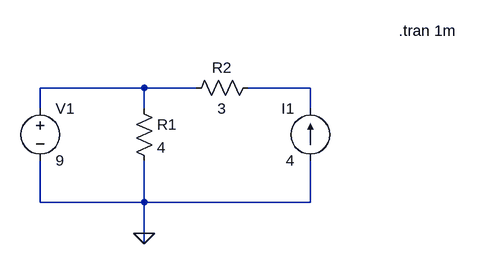
[diagram p0: schematic Q3 att 3.asc]
Q3 att 3.asc, the LTspice schematic file:
Version 4.1
SHEET 1 880 680
WIRE 144 112 -16 112
WIRE 224 112 144 112
WIRE 400 112 304 112
WIRE -16 144 -16 112
WIRE 144 144 144 112
WIRE 400 144 400 112
WIRE -16 288 -16 224
WIRE 144 288 144 224
WIRE 144 288 -16 288
WIRE 400 288 400 224
WIRE 400 288 144 288
WIRE 144 336 144 288
WIRE 144 352 144 336
FLAG 144 336 0
SYMBOL res 128 128 R0
SYMATTR InstName R1
SYMATTR Value 4
SYMBOL res 320 96 R90
WINDOW 0 0 56 VBottom 2
WINDOW 3 32 56 VTop 2
SYMATTR InstName R2
SYMATTR Value 3
SYMBOL voltage -16 128 R0
WINDOW 123 0 0 Left 0
WINDOW 39 0 0 Left 0
SYMATTR InstName V1
SYMATTR Value 9
SYMBOL current 400 224 R180
WINDOW 0 24 80 Left 2
WINDOW 3 24 0 Left 2
WINDOW 123 0 0 Left 0
WINDOW 39 0 0 Left 0
SYMATTR InstName I1
SYMATTR Value 4
TEXT 536 24 Left 2 !.tran 1m

The netlist it stands for:
* Q3 att 3.asc
R1 N001 0 4
R2 N002 N001 3
V1 N001 0 9
I1 0 N002 4
.tran 1m
.backanno
.end